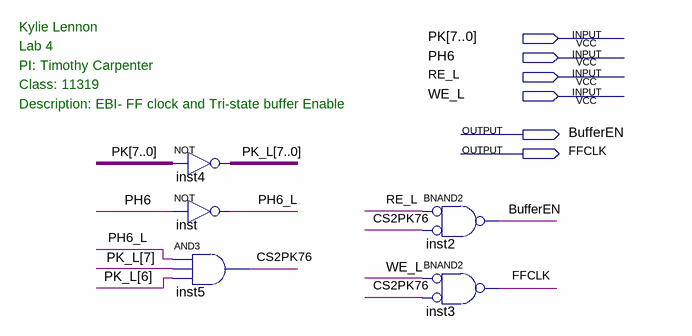
[diagram p0: schematic sheet]
// Quartus schematic Lab4.bdf as structural Verilog: 5 symbols, 6 pins
module Lab4 (
  input  [7:0] PK,
  input  PH6,
  input  RE_L,
  input  WE_L,
  output BufferEN,
  output FFCLK
);

  wire CS2PK76, PH6_L;
  wire [7:0] PK_L;

  assign PK_L = ~PK;  // NOT inst4, 8 bits wide
  not inst (PH6_L, PH6);
  and inst5 (CS2PK76, PH6_L, PK_L[7], PK_L[6]);
  nand inst2 (BufferEN, ~RE_L, ~CS2PK76);  // BNAND2
  nand inst3 (FFCLK, ~WE_L, ~CS2PK76);  // BNAND2

  // Notes on the sheet:
  //   Kylie Lennon
  //   Lab 4
  //   PI: Timothy Carpenter
  //   Class: 11319
  //   Description: EBI- FF clock and Tri-state buffer Enable 
endmodule
